# Altium schematic sheet CM5_Schem_V2.SchDoc (part 1 of 3)
size A1; SheetNumber: 2; SheetTotal: 3
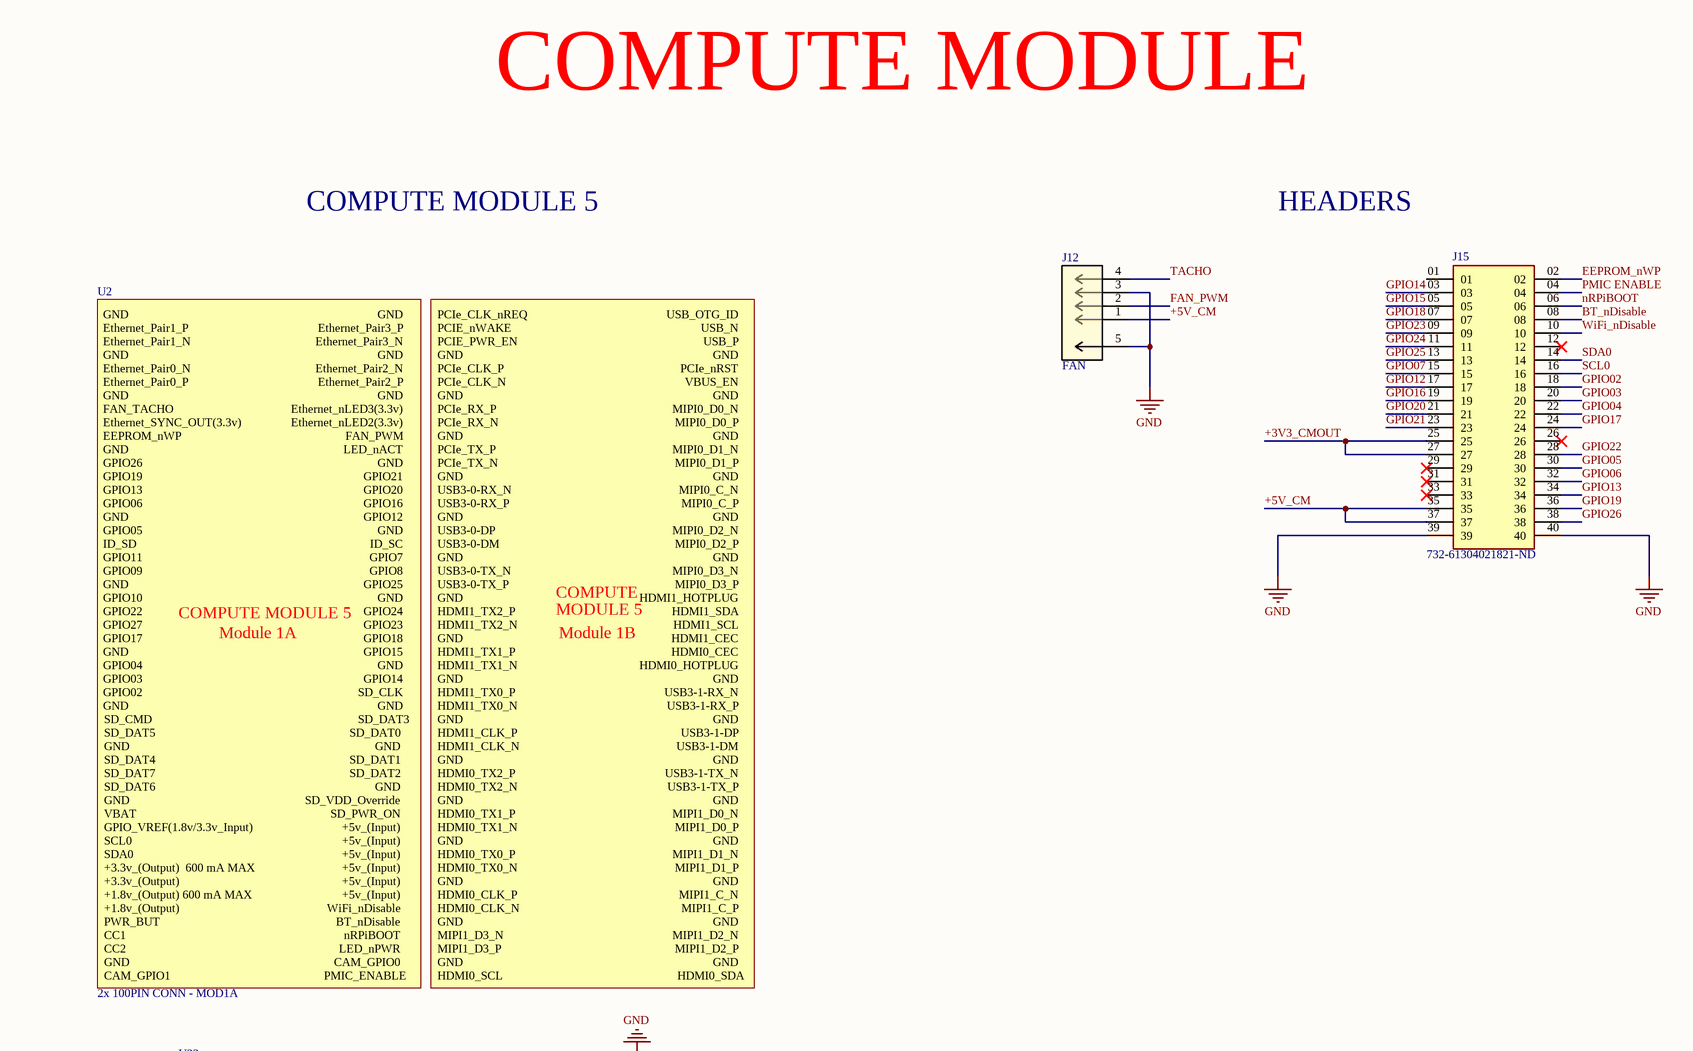
[diagram p0: CM5_Schem_V2.SchDoc, top left]
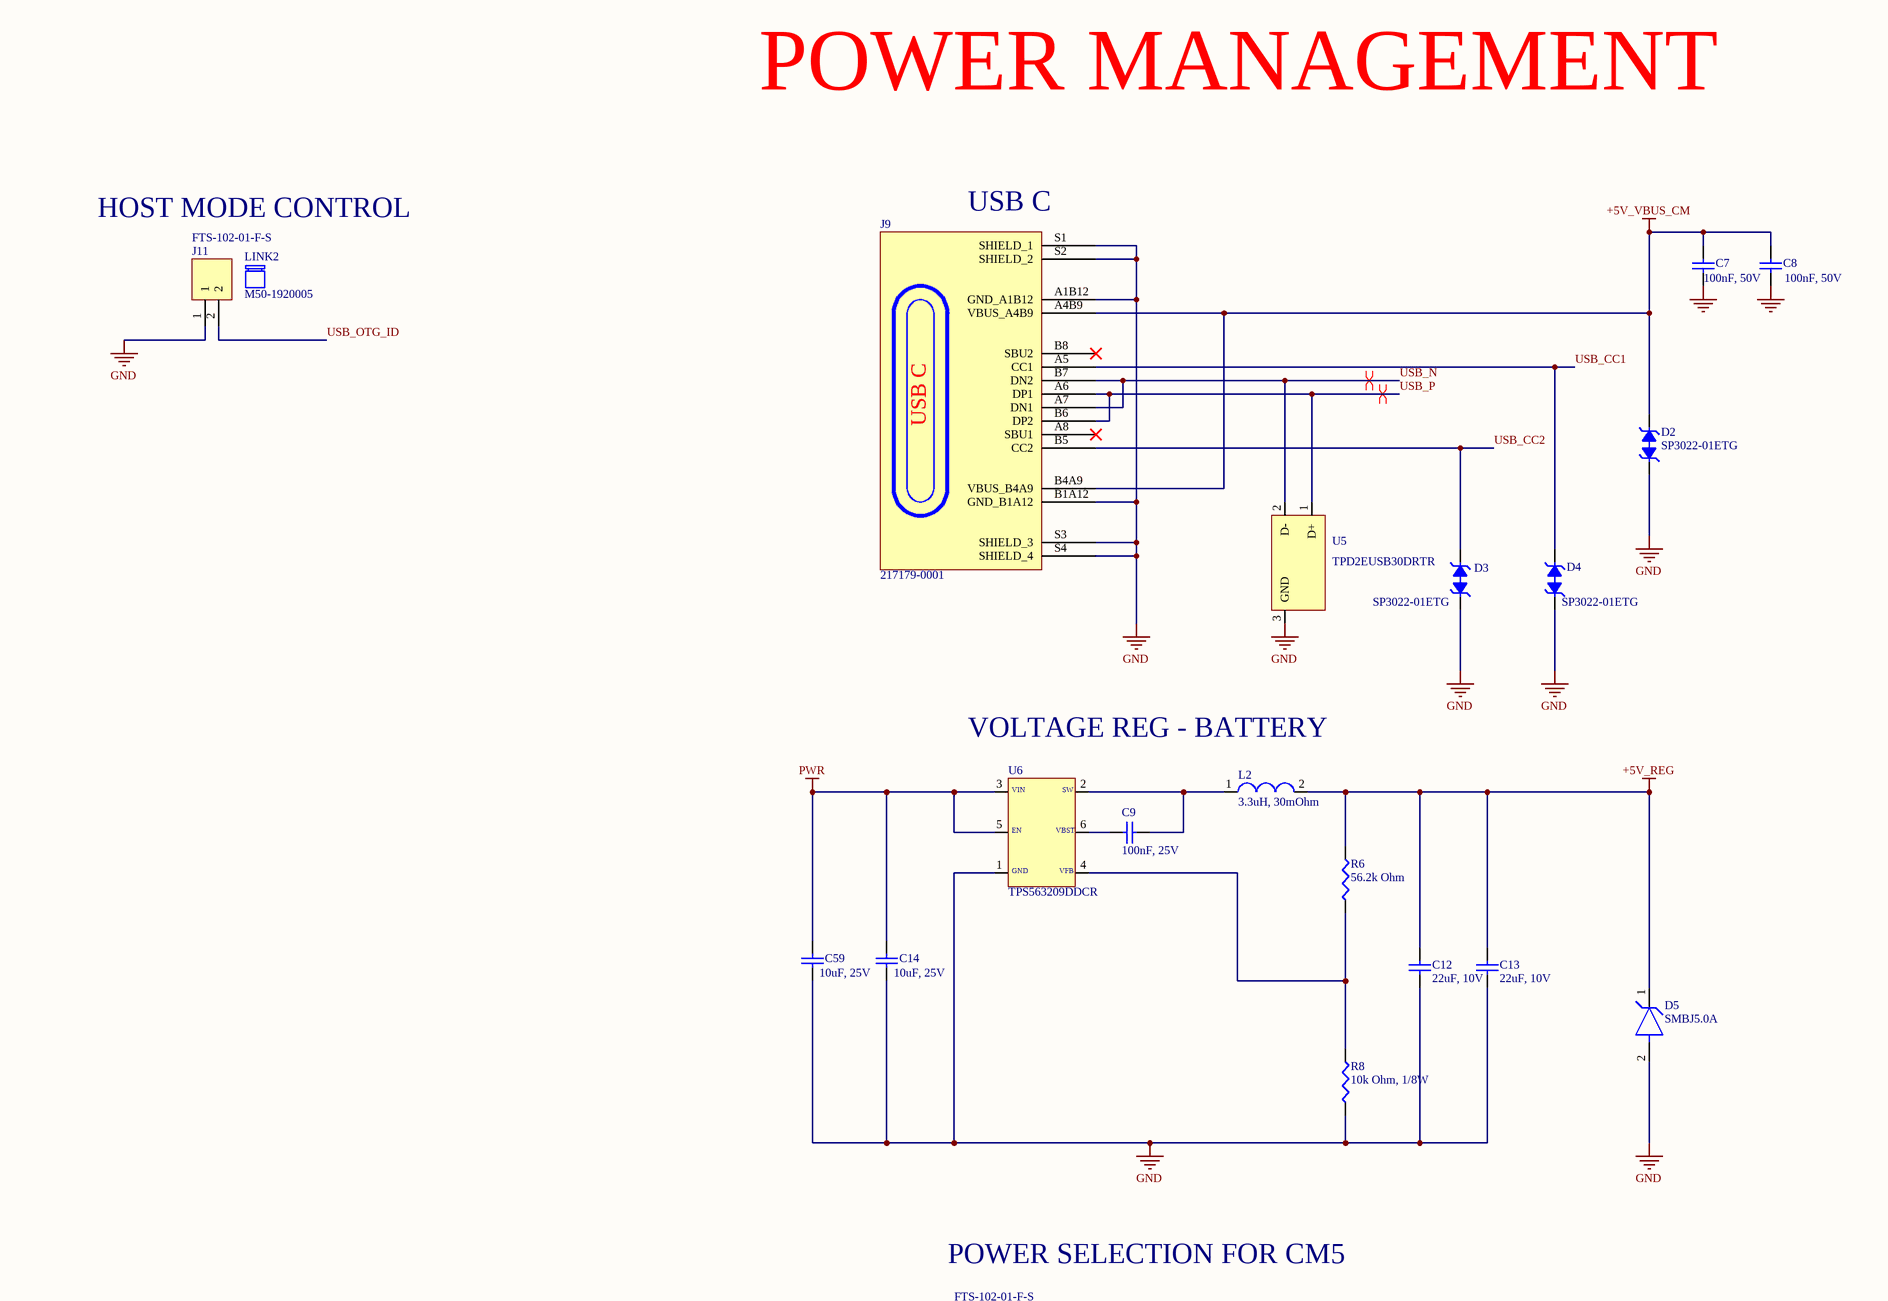
[diagram p1: CM5_Schem_V2.SchDoc, top right]
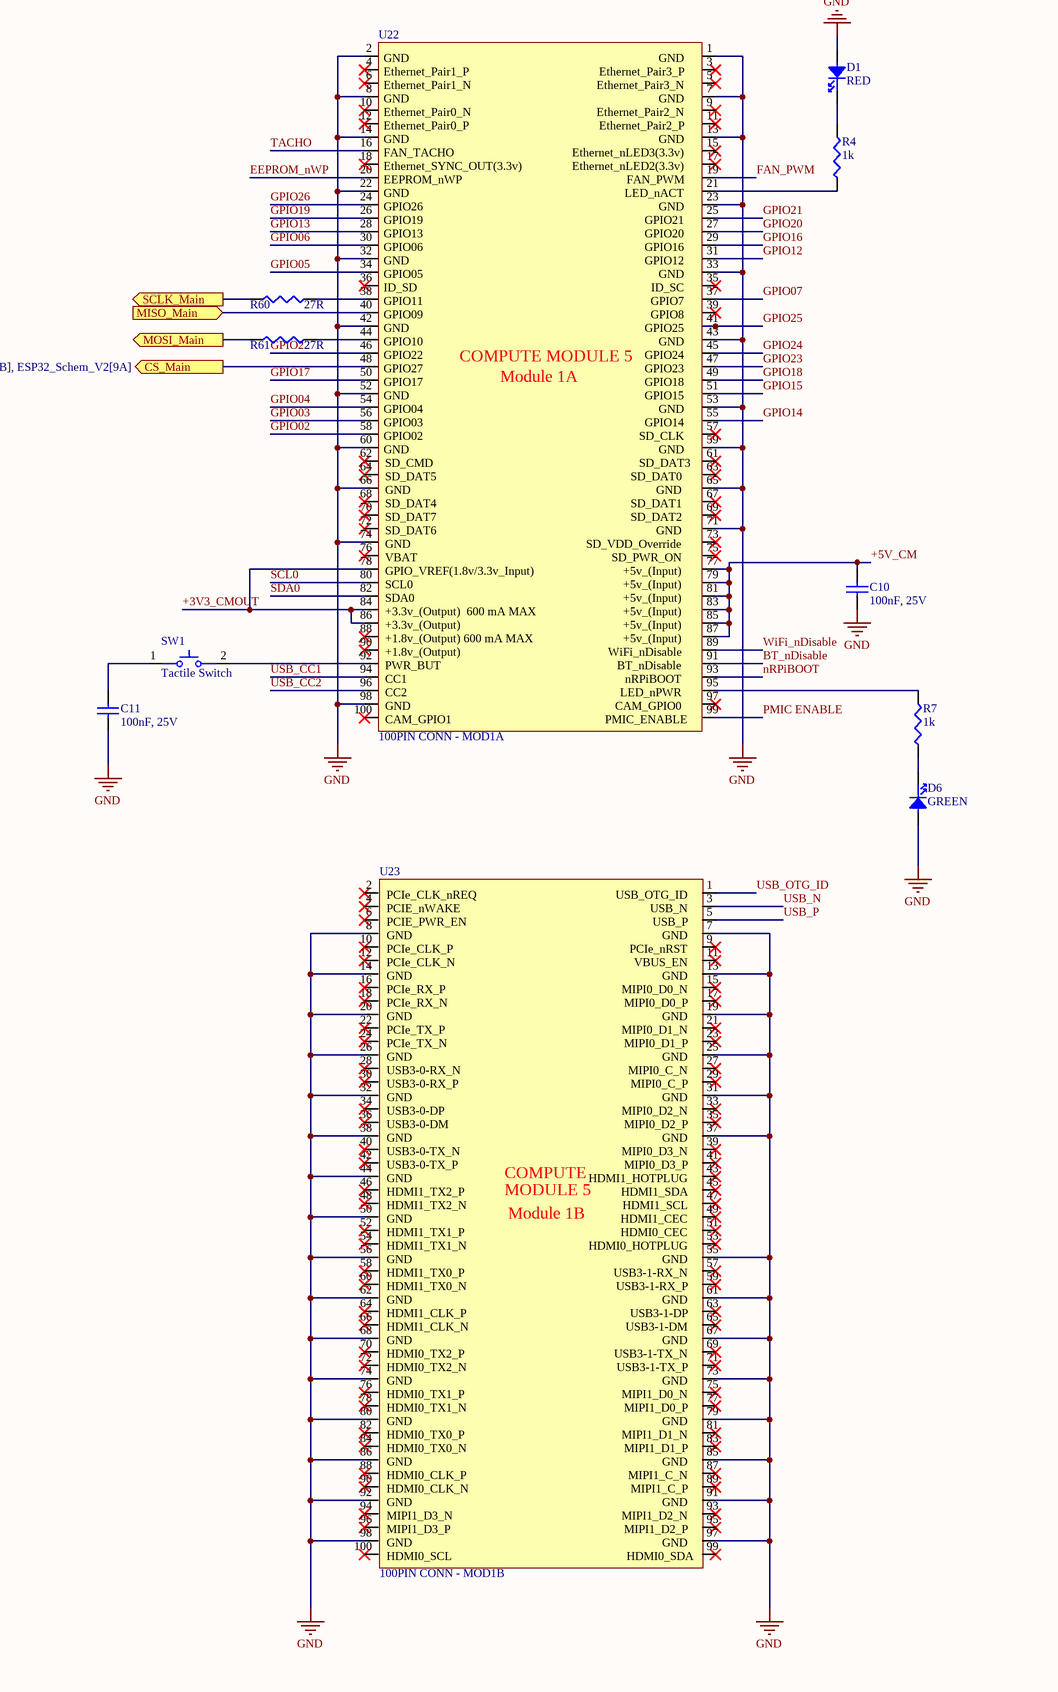
[diagram p2: CM5_Schem_V2.SchDoc, bottom left]
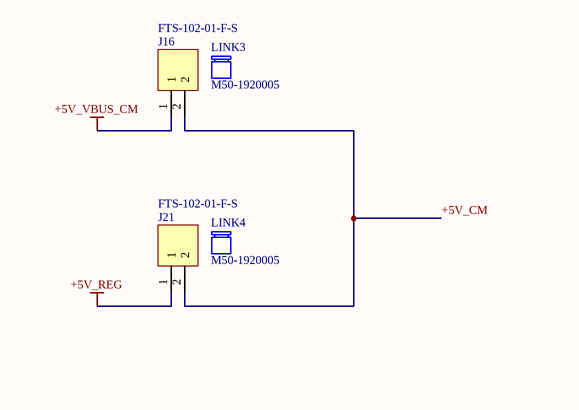
[diagram p3: CM5_Schem_V2.SchDoc, bottom right]

## Parts
C7  100nF, 50V  [CAPC1005X55N]
C8  100nF, 50V  [CAPC1005X55N]
C9  100nF, 25V  [CAP_X7R_0805_AVX-M]
C10  100nF, 25V  [CAP_X7R_0805_AVX-M]
C11  100nF, 25V  [CAP_X7R_0805_AVX-M]
C12  22uF, 10V  [CAP_1608_TDK-M]
C13  22uF, 10V  [CAP_1608_TDK-M]
C14  10uF, 25V  [CAPC2012X95N]
C59  10uF, 25V  [CAPC2012X95N]
D1  RED  [LED0402R]
D2  SP3022-01ETG  [SOD882]
D3  SP3022-01ETG  [SOD882]
D4  SP3022-01ETG  [SOD882]
D5  SMBJ5.0A  [DO-214AASMB_J-BEND_LTF-M]
D6  GREEN  [LED0402G]
J9  217179-0001  [FP-2171790001-MFG]
J11  FTS-102-01-F-S  [HDR_1x2_1.27MM]
J12  FAN  [CONN4_BM04B-SRSS_JST]
J15  732-61304021821-ND  [SAMTEC_MTSW-120-X-X-D-X]
J16  FTS-102-01-F-S  [HDR_1x2_1.27MM]
J21  FTS-102-01-F-S  [HDR_1x2_1.27MM]
L2  3.3uH, 30mOhm  [IND_VLS6045EX-3R3N]
LINK2  M50-1920005  (mechanical)
LINK3  M50-1920005  (mechanical)
LINK4  M50-1920005  (mechanical)
R4  1k  [RESC1005X40N]
R6  56.2k Ohm  [RESC0603X26N]
R7  1k  [RESC1005X40N]
R8  10k Ohm, 1/8W  [RESC1005X40N]
R60  27R  [RESC1005X37N]
R61  27R  [RESC1005X37N]
SW1  Tactile Switch  [SWITCH_43SMTR92LFS]
U2  2x 100PIN CONN - MOD1A  [RPI CM5]
U5  TPD2EUSB30DRTR  [SOTFL35P100X50-3N]
U6  TPS563209DDCR  [DDC0006A]
U22  100PIN CONN - MOD1A  [HIROSE_DF40C-100DS-0.4V(51)]
U23  100PIN CONN - MOD1B  [HIROSE_DF40C-100DS-0.4V(51)]

## Ports
CS_Main (out, see TopSheet[5B], ESP32_Schem_V2[9A]), MISO_Main (in, see TopSheet[5B], ESP32_Schem_V2[9A]), MOSI_Main (out, see TopSheet[5B], ESP32_Schem_V2[9A]), SCLK_Main (out, see TopSheet[5B], ESP32_Schem_V2[9A])

## Nets
+5V_REG: C12.1 C13.1 D5.1 J21.1 L2.2 R6.2
+5V_VBUS_CM: C7.2 C8.2 D2.2 J9.A4B9(VBUS_A4B9) J9.B4A9(VBUS_B4A9) J16.1
GND: C7.1 C8.1 C10.1 C11.1 C12.2 C13.2 C14.1 C59.1 D1.2 D2.1 D3.1 D4.1 D5.2 D6.2 J9.A1B12(GND_A1B12) J9.B1A12(GND_B1A12) J9.S1(SHIELD_1) J9.S2(SHIELD_2) J9.S3(SHIELD_3) J9.S4(SHIELD_4) J11.1 J12.3 J12.5 J15.39 J15.40 R8.1 U5.3(GND) U6.1 U22.1 U22.2 U22.7 U22.8 U22.13 U22.14 U22.22 U22.23 U22.32 U22.33 U22.42 U22.43 U22.52 U22.53 U22.59 U22.60 U22.65 U22.66 U22.71 U22.74 U22.98 U23.7 U23.8 U23.13 U23.14 U23.19 U23.20 U23.25 U23.26 U23.31 U23.32 U23.37 U23.38 U23.44 U23.50 U23.55 U23.56 U23.61 U23.62 U23.67 U23.68 U23.73 U23.74 U23.79 U23.80 U23.85 U23.86 U23.91 U23.92 U23.97 U23.98
PWR: C14.2 C59.2 U6.3 U6.5
+3V3_CMOUT: J15.25 J15.27 U22.78 U22.84 U22.86
+5V_CM: C10.2 J12.1 J15.35 J15.37 J16.2 J21.2 U22.77 U22.79 U22.81 U22.83 U22.85 U22.87
BT_nDisable: J15.08 U22.91
CS_Main: U22.48 ; port CS_Main
EEPROM_nWP: J15.02 U22.20
FAN_PWM: J12.2 U22.19
GPIO02: J15.18 U22.58
GPIO03: J15.20 U22.56
GPIO04: J15.22 U22.54
GPIO05: J15.30 U22.34
GPIO06: J15.32 U22.30
GPIO07: J15.15 U22.37
GPIO12: J15.17 U22.31
GPIO13: J15.34 U22.28
GPIO14: J15.03 U22.55
GPIO15: J15.05 U22.51
GPIO16: J15.19 U22.29
GPIO17: J15.24 U22.50
GPIO18: J15.07 U22.49
GPIO19: J15.36 U22.26
GPIO20: J15.21 U22.27
GPIO21: J15.23 U22.25
GPIO22: J15.28 U22.46
GPIO23: J15.09 U22.47
GPIO24: J15.11 U22.45
GPIO25: J15.13 U22.41
GPIO26: J15.38 U22.24
MISO_Main: U22.40 ; port MISO_Main
MOSI_Main: R61.1 ; port MOSI_Main
nRPiBOOT: J15.06 U22.93
PMIC ENABLE: J15.04 U22.99
SCL0: J15.16 U22.80
SCLK_Main: R60.1 ; port SCLK_Main
SDA0: J15.14 U22.82
TACHO: J12.4 U22.16
USB_CC1: D4.2 J9.A5(CC1) U22.94
USB_CC2: D3.2 J9.B5(CC2) U22.96
USB_N: J9.A7(DN1) J9.B7(DN2) U5.2(D-) U23.3
USB_OTG_ID: J11.2 U23.1
USB_P: J9.A6(DP1) J9.B6(DP2) U5.1(D+) U23.5
WiFi_nDisable: J15.10 U22.89
NetC9_1: C9.1 U6.6
NetC9_2: C9.2 L2.1 U6.2
NetC11_2: C11.2 SW1.1
NetD1_1: D1.1 R4.2
NetD6_1: D6.1 R7.1
NetR4_1: R4.1 U22.21
NetR6_1: R6.1 R8.2 U6.4
NetR7_2: R7.2 U22.95
NetR60_2: R60.2 U22.38
NetR61_2: R61.2 U22.44
NetSW1_2: SW1.2 U22.92

Not connected (* = marked no-connect by the designer): J9 A8(SBU1)* B8(SBU2)*; J15 01 12* 26* 29* 31* 33*; U22 3* 4* 5* 6* 9* 10* 11* 12* 15* 17* 18* 35* 36* 39* 57* 61* 62* 63* 64* 67* 68* 69* 70* 72* 73* 75* 76* 88* 90* 97* 100*; U23 2* 4* 6* 9* 10* 11* 12* 15* 16* 17* 18* 21* 22* 23* 24* 27* 28* 29* 30* 33* 34* 35* 36* 39* 40* 41* 42* 43* 45* 46* 47* 48* 49* 51* 52* 53* 54* 57* 58* 59* 60* 63* 64* 65* 66* 69* 70* 71* 72* 75* 76* 77* 78* 81* 82* 83* 84* 87* 88* 89* 90* 93* 94* 95* 96* 99* 100*

## Layout directives
differential pair; differential pair class DIFF90: USB_N, USB_P

## Notes on the sheet
- COMPUTE MODULE
- POWER MANAGEMENT
- COMPUTE MODULE 5
- HEADERS
- (near J9) USB C
- (near LINK2) HOST MODE CONTROL
- VOLTAGE REG - BATTERY
- POWER SELECTION FOR CM5
- (in symbol 217179-0001) USB C
- (in symbol CM5 Courtyard) COMPUTE; COMPUTE MODULE 5; MODULE 5; Module 1A; Module 1B; GND / Ethernet_Pair1_P / Ethernet_Pair1_N / GND / Ethernet_Pair0_N / Ethernet_Pair0_P / GND / FAN_TACHO / Ethernet_SYNC_OUT(3.3v) / EEPROM_nWP / GND / GPIO26 / GPIO19 / GPIO13 / GPIO06 / GND / GPIO05 / ID_SD / GPIO11 / GPIO09 / GND / GPIO10 / GPIO22 / GPIO27 / GPIO17 / GND / GPIO04 / GPIO03 / GPIO02 / GND; GND / Ethernet_Pair3_P / Ethernet_Pair3_N / GND / Ethernet_Pair2_N / Ethernet_Pair2_P / GND / Ethernet_nLED3(3.3v) / Ethernet_nLED2(3.3v) / FAN_PWM / LED_nACT / GND / GPIO21 / GPIO20 / GPIO16 / GPIO12 / GND / ID_SC / GPIO7 / GPIO8 / GPIO25 / GND / GPIO24 / GPIO23 / GPIO18 / GPIO15 / GND / GPIO14 / SD_CLK / GND / SD_DAT3; SD_CMD / SD_DAT5 / GND / SD_DAT4 / SD_DAT7 / SD_DAT6 / GND / VBAT / GPIO_VREF(1.8v/3.3v_Input) / SCL0 / SDA0 / +3.3v_(Output)  600 mA MAX / +3.3v_(Output) / +1.8v_(Output) 600 mA MAX / +1.8v_(Output) / PWR_BUT / CC1 / CC2 / GND / CAM_GPIO1; SD_DAT0 / GND / SD_DAT1 / SD_DAT2 / GND / SD_VDD_Override / SD_PWR_ON / +5v_(Input) / +5v_(Input) / +5v_(Input) / +5v_(Input) / +5v_(Input) / +5v_(Input) / WiFi_nDisable / BT_nDisable / nRPiBOOT / LED_nPWR / CAM_GPIO0 / PMIC_ENABLE; PCIe_CLK_nREQ / PCIE_nWAKE / PCIE_PWR_EN / GND / PCIe_CLK_P / PCIe_CLK_N / GND / PCIe_RX_P / PCIe_RX_N / GND / PCIe_TX_P / PCIe_TX_N / GND / USB3-0-RX_N / USB3-0-RX_P / GND / USB3-0-DP / USB3-0-DM / GND / USB3-0-TX_N / USB3-0-TX_P / GND / HDMI1_TX2_P / HDMI1_TX2_N / GND / HDMI1_TX1_P / HDMI1_TX1_N / GND / HDMI1_TX0_P / HDMI1_TX0_N / GND / HDMI1_CLK_P / HDMI1_CLK_N / GND / HDMI0_TX2_P / HDMI0_TX2_N / GND / HDMI0_TX1_P / HDMI0_TX1_N / GND / HDMI0_TX0_P / HDMI0_TX0_N / GND / HDMI0_CLK_P / HDMI0_CLK_N / GND / MIPI1_D3_N / MIPI1_D3_P / GND / HDMI0_SCL; USB_OTG_ID / USB_N / USB_P / GND / PCIe_nRST / VBUS_EN / GND / MIPI0_D0_N / MIPI0_D0_P / GND / MIPI0_D1_N / MIPI0_D1_P / GND / MIPI0_C_N / MIPI0_C_P / GND / MIPI0_D2_N / MIPI0_D2_P / GND / MIPI0_D3_N / MIPI0_D3_P / HDMI1_HOTPLUG / HDMI1_SDA / HDMI1_SCL / HDMI1_CEC / HDMI0_CEC / HDMI0_HOTPLUG / GND / USB3-1-RX_N / USB3-1-RX_P / GND / USB3-1-DP / USB3-1-DM / GND / USB3-1-TX_N / USB3-1-TX_P / GND / MIPI1_D0_N / MIPI1_D0_P / GND / MIPI1_D1_N / MIPI1_D1_P / GND / MIPI1_C_N / MIPI1_C_P / GND / MIPI1_D2_N / MIPI1_D2_P / GND / HDMI0_SDA
- (in symbol DF40C-100DS-0.4V(51)_MOD1A) /; COMPUTE MODULE 5; Module 1A; GND / Ethernet_Pair1_P / Ethernet_Pair1_N / GND / Ethernet_Pair0_N / Ethernet_Pair0_P / GND / FAN_TACHO / Ethernet_SYNC_OUT(3.3v) / EEPROM_nWP / GND / GPIO26 / GPIO19 / GPIO13 / GPIO06 / GND / GPIO05 / ID_SD / GPIO11 / GPIO09 / GND / GPIO10 / GPIO22 / GPIO27 / GPIO17 / GND / GPIO04 / GPIO03 / GPIO02 / GND; GND / Ethernet_Pair3_P / Ethernet_Pair3_N / GND / Ethernet_Pair2_N / Ethernet_Pair2_P / GND / Ethernet_nLED3(3.3v) / Ethernet_nLED2(3.3v) / FAN_PWM / LED_nACT / GND / GPIO21 / GPIO20 / GPIO16 / GPIO12 / GND / ID_SC / GPIO7 / GPIO8 / GPIO25 / GND / GPIO24 / GPIO23 / GPIO18 / GPIO15 / GND / GPIO14 / SD_CLK / GND / SD_DAT3; SD_CMD / SD_DAT5 / GND / SD_DAT4 / SD_DAT7 / SD_DAT6 / GND / VBAT / GPIO_VREF(1.8v/3.3v_Input) / SCL0 / SDA0 / +3.3v_(Output)  600 mA MAX / +3.3v_(Output) / +1.8v_(Output) 600 mA MAX / +1.8v_(Output) / PWR_BUT / CC1 / CC2 / GND / CAM_GPIO1; SD_DAT0 / GND / SD_DAT1 / SD_DAT2 / GND / SD_VDD_Override / SD_PWR_ON / +5v_(Input) / +5v_(Input) / +5v_(Input) / +5v_(Input) / +5v_(Input) / +5v_(Input) / WiFi_nDisable / BT_nDisable / nRPiBOOT / LED_nPWR / CAM_GPIO0 / PMIC_ENABLE
- (in symbol DF40C-100DS-0.4V(51)_MOD1B) /; COMPUTE; MODULE 5; Module 1B; PCIe_CLK_nREQ / PCIE_nWAKE / PCIE_PWR_EN / GND / PCIe_CLK_P / PCIe_CLK_N / GND / PCIe_RX_P / PCIe_RX_N / GND / PCIe_TX_P / PCIe_TX_N / GND / USB3-0-RX_N / USB3-0-RX_P / GND / USB3-0-DP / USB3-0-DM / GND / USB3-0-TX_N / USB3-0-TX_P / GND / HDMI1_TX2_P / HDMI1_TX2_N / GND / HDMI1_TX1_P / HDMI1_TX1_N / GND / HDMI1_TX0_P / HDMI1_TX0_N / GND / HDMI1_CLK_P / HDMI1_CLK_N / GND / HDMI0_TX2_P / HDMI0_TX2_N / GND / HDMI0_TX1_P / HDMI0_TX1_N / GND / HDMI0_TX0_P / HDMI0_TX0_N / GND / HDMI0_CLK_P / HDMI0_CLK_N / GND / MIPI1_D3_N / MIPI1_D3_P / GND / HDMI0_SCL; USB_OTG_ID / USB_N / USB_P / GND / PCIe_nRST / VBUS_EN / GND / MIPI0_D0_N / MIPI0_D0_P / GND / MIPI0_D1_N / MIPI0_D1_P / GND / MIPI0_C_N / MIPI0_C_P / GND / MIPI0_D2_N / MIPI0_D2_P / GND / MIPI0_D3_N / MIPI0_D3_P / HDMI1_HOTPLUG / HDMI1_SDA / HDMI1_SCL / HDMI1_CEC / HDMI0_CEC / HDMI0_HOTPLUG / GND / USB3-1-RX_N / USB3-1-RX_P / GND / USB3-1-DP / USB3-1-DM / GND / USB3-1-TX_N / USB3-1-TX_P / GND / MIPI1_D0_N / MIPI1_D0_P / GND / MIPI1_D1_N / MIPI1_D1_P / GND / MIPI1_C_N / MIPI1_C_P / GND / MIPI1_D2_N / MIPI1_D2_P / GND / HDMI0_SDA
- (in symbol TPS563209DDCR) VIN; SW; EN; VBST; GND; VFB